# Altium schematic sheet vesc.SchDoc
size A4; SheetNumber: 1; SheetTotal: 5
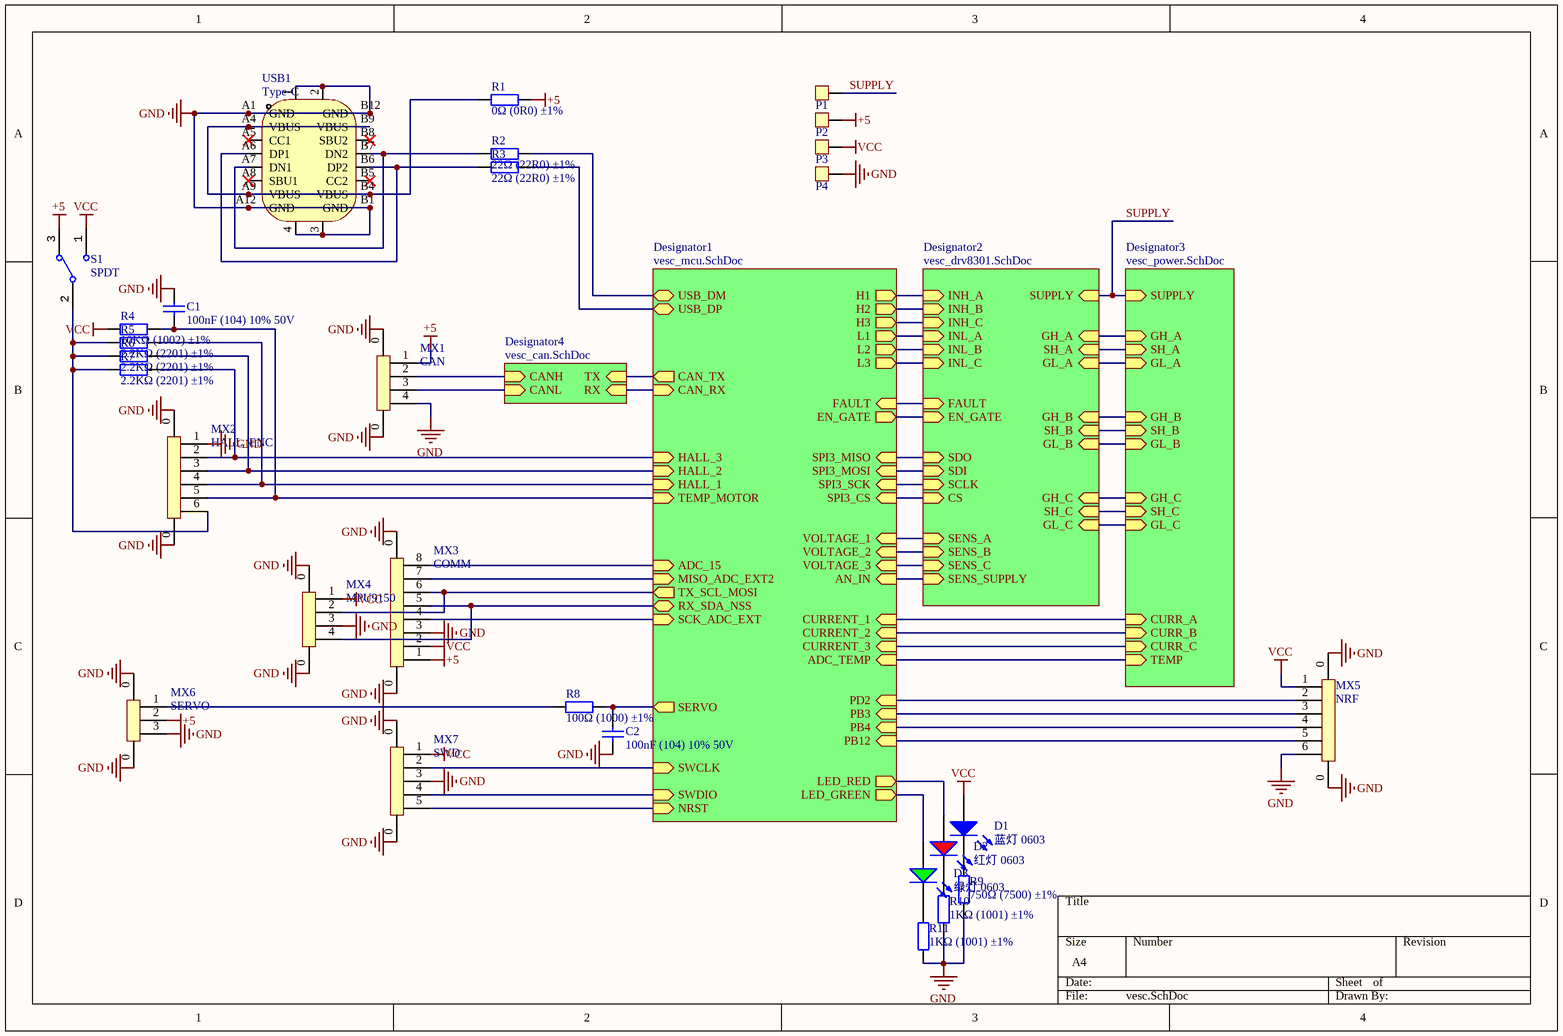
[diagram p0: vesc.SchDoc]

## Parts
C1  100nF (104) 10% 50V  [0603_C]
C2  100nF (104) 10% 50V  [0603_C]
D1  蓝灯 0603  [0603_LED_S1]
D2  红灯 0603  [0603_LED_S1]
D3  绿灯 0603  [0603_LED_S1]
MX1  CAN  [MX 1.25-WS-4P]
MX2  HALL_ENC  [MX 1.25-WS-6P]
MX3  COMM  [MX 1.25-WS-8P]
MX4  MPU9150  [MX 1.25-WS-4P]
MX5  NRF  [MX 1.25-WS-6P]
MX6  SERVO  [MX 1.25-WS-3P]
MX7  SWD  [MX 1.25-WS-5P]
P1  PAD  [PAD]  (value not drawn)
P2  PAD  [PAD]  (value not drawn)
P3  PAD  [PAD]  (value not drawn)
P4  PAD  [PAD]  (value not drawn)
R1  0Ω (0R0) ±1%  [0603_R]
R2  22Ω (22R0) ±1%  [0603_R]
R3  22Ω (22R0) ±1%  [0603_R]
R4  10KΩ (1002) ±1%  [0603_R]
R5  2.2KΩ (2201) ±1%  [0603_R]
R6  2.2KΩ (2201) ±1%  [0603_R]
R7  2.2KΩ (2201) ±1%  [0603_R]
R8  100Ω (1000) ±1%  [0603_R]
R9  750Ω (7500) ±1%  [0603_R]
R10  1KΩ (1001) ±1%  [0603_R]
R11  1KΩ (1001) ±1%  [0603_R]
S1  SPDT  [SwitchSPDT_4.3X8.6_D90]
USB1  Type-C  [TYPE-C_16P]

## Sub-sheets
Designator1 = vesc_mcu.SchDoc: NRST (in), VOLTAGE_1 (in), VOLTAGE_2 (in), VOLTAGE_3 (in), ADC_TEMP (in), RX_SDA_NSS (bidir), SCK_ADC_EXT (in), MISO_ADC_EXT2 (in), H1 (out), H2 (out), H3 (out), USB_DM (bidir), USB_DP (bidir), SWDIO (in), SWCLK (in), LED_GREEN (out), LED_RED (out), PB3 (in), PB4 (in), EN_GATE (out), SERVO (out), FAULT (in), CAN_RX (in), CAN_TX (out), PB12 (in), L1 (out), L2 (out), L3 (out), TX_SCL_MOSI (out), CURRENT_1 (in), CURRENT_2 (in), CURRENT_3 (in), AN_IN (in), TEMP_MOTOR (in), ADC_15 (in), HALL_1 (in), HALL_2 (in), HALL_3 (in), SPI3_CS (in), SPI3_SCK (in), SPI3_MISO (in), SPI3_MOSI (in), PD2 (in)
Designator2 = vesc_drv8301.SchDoc: SENS_SUPPLY (in), SUPPLY (in), SENS_A (in), SH_A (in), SENS_B (in), SENS_C (in), SH_C (in), FAULT (in), CS (in), SDI (in), SDO (in), SCLK (in), EN_GATE (in), INH_A (in), INL_A (in), INH_B (in), INL_B (in), INH_C (in), INL_C (in), GH_A (in), GL_A (in), GH_B (in), GL_B (in), GH_C (in), GL_C (in), SH_B (in)
Designator3 = vesc_power.SchDoc: GH_A (in), GL_A (in), SH_A (in), GH_B (in), GL_B (in), SH_B (in), GH_C (in), GL_C (in), SH_C (in), CURR_A (in), CURR_B (in), CURR_C (in), TEMP (in), SUPPLY (in)
Designator4 = vesc_can.SchDoc: TX (in), RX (in), CANH (in), CANL (in)

## Nets
+5: MX1.1 MX3.1 MX6.2 P2.1 R1.2 S1.3
GND: C1.2 C2.1 MX1.0 MX1.4 MX2.0 MX2.1 MX3.0 MX3.3 MX4.0 MX4.3 MX5.0 MX5.6 MX6.0 MX6.3 MX7.0 MX7.3 P4.1 R9.1 R10.1 R11.1 USB1.1 USB1.2 USB1.3 USB1.4 USB1.A1(GND) USB1.A12(GND) USB1.B1(GND) USB1.B12(GND)
VCC: D1.A MX3.2 MX4.1 MX5.1 MX7.1 P3.1 R4.1 S1.1
SUPPLY: P1.1 ; sheet Designator2/SUPPLY, sheet Designator3/SUPPLY
NetC1_1: C1.1 MX2.5 R4.2 ; sheet Designator1/TEMP_MOTOR
NetC2_2: C2.2 R8.2 ; sheet Designator1/SERVO
NetD1_K: D1.K R9.2
NetD2_A: D2.A ; sheet Designator1/LED_RED
NetD2_K: D2.K R10.2
NetD3_A: D3.A ; sheet Designator1/LED_GREEN
NetD3_K: D3.K R11.2
NetMX1_2: MX1.2 ; sheet Designator4/CANH
NetMX1_3: MX1.3 ; sheet Designator4/CANL
NetMX2_2: MX2.2 R7.2 ; sheet Designator1/HALL_3
NetMX2_3: MX2.3 R6.2 ; sheet Designator1/HALL_2
NetMX2_4: MX2.4 R5.2 ; sheet Designator1/HALL_1
NetMX2_6: MX2.6 R5.1 R6.1 R7.1 S1.2
NetMX3_4: MX3.4 ; sheet Designator1/SCK_ADC_EXT
NetMX3_5: MX3.5 MX4.4 ; sheet Designator1/RX_SDA_NSS
NetMX3_6: MX3.6 MX4.2 ; sheet Designator1/TX_SCL_MOSI
NetMX3_7: MX3.7 ; sheet Designator1/MISO_ADC_EXT2
NetMX3_8: MX3.8 ; sheet Designator1/ADC_15
NetMX5_2: MX5.2 ; sheet Designator1/PD2
NetMX5_3: MX5.3 ; sheet Designator1/PB3
NetMX5_4: MX5.4 ; sheet Designator1/PB4
NetMX5_5: MX5.5 ; sheet Designator1/PB12
NetMX6_1: MX6.1 R8.1
NetMX7_2: MX7.2 ; sheet Designator1/SWCLK
NetMX7_4: MX7.4 ; sheet Designator1/SWDIO
NetMX7_5: MX7.5 ; sheet Designator1/NRST
NetR1_1: R1.1 USB1.A4(VBUS) USB1.A9(VBUS) USB1.B4(VBUS) USB1.B9(VBUS)
NetR2_1: R2.1 USB1.A7(DN1) USB1.B7(DN2)
NetR2_2: R2.2 ; sheet Designator1/USB_DM
NetR3_1: R3.1 USB1.A6(DP1) USB1.B6(DP2)
NetR3_2: R3.2 ; sheet Designator1/USB_DP
(unnamed): sheet Designator4/TX, sheet Designator1/CAN_TX
(unnamed): sheet Designator4/RX, sheet Designator1/CAN_RX
(unnamed): sheet Designator1/VOLTAGE_1, sheet Designator2/SENS_A
(unnamed): sheet Designator1/VOLTAGE_2, sheet Designator2/SENS_B
(unnamed): sheet Designator1/VOLTAGE_3, sheet Designator2/SENS_C
(unnamed): sheet Designator1/ADC_TEMP, sheet Designator3/TEMP
(unnamed): sheet Designator1/H1, sheet Designator2/INH_A
(unnamed): sheet Designator1/H2, sheet Designator2/INH_B
(unnamed): sheet Designator1/H3, sheet Designator2/INH_C
(unnamed): sheet Designator1/EN_GATE, sheet Designator2/EN_GATE
(unnamed): sheet Designator1/FAULT, sheet Designator2/FAULT
(unnamed): sheet Designator1/L1, sheet Designator2/INL_A
(unnamed): sheet Designator1/L2, sheet Designator2/INL_B
(unnamed): sheet Designator1/L3, sheet Designator2/INL_C
(unnamed): sheet Designator1/CURRENT_1, sheet Designator3/CURR_A
(unnamed): sheet Designator1/CURRENT_2, sheet Designator3/CURR_B
(unnamed): sheet Designator1/CURRENT_3, sheet Designator3/CURR_C
(unnamed): sheet Designator1/AN_IN, sheet Designator2/SENS_SUPPLY
(unnamed): sheet Designator1/SPI3_CS, sheet Designator2/CS
(unnamed): sheet Designator1/SPI3_SCK, sheet Designator2/SCLK
(unnamed): sheet Designator1/SPI3_MISO, sheet Designator2/SDO
(unnamed): sheet Designator1/SPI3_MOSI, sheet Designator2/SDI
(unnamed): sheet Designator2/SH_A, sheet Designator3/SH_A
(unnamed): sheet Designator2/SH_C, sheet Designator3/SH_C
(unnamed): sheet Designator2/GH_A, sheet Designator3/GH_A
(unnamed): sheet Designator2/GL_A, sheet Designator3/GL_A
(unnamed): sheet Designator2/GH_B, sheet Designator3/GH_B
(unnamed): sheet Designator2/GL_B, sheet Designator3/GL_B
(unnamed): sheet Designator2/GH_C, sheet Designator3/GH_C
(unnamed): sheet Designator2/GL_C, sheet Designator3/GL_C
(unnamed): sheet Designator2/SH_B, sheet Designator3/SH_B

Not connected (* = marked no-connect by the designer): USB1 A5(CC1)* A8(SBU1)* B5(CC2)* B8(SBU2)*

## Library data of the parts
C1 C2 = 0603 100nF (104) 10% 50V: 贴片电容; ComponentLink1Description: 供应商链接; ComponentLink1URL: http://www.szlcsc.com/product/details_15331.html; Package: 0603; Supplier: LC; SuppliersPartNumber: C14663
D1 = 0603 蓝灯: 发光二极管; ComponentLink1Description: 供应商链接; ComponentLink1URL: http://www.szlcsc.com/product/details_73150.html; Package: 0603; Supplier: LC; SuppliersPartNumber: C72041
D2 = 0603 红灯: 发光二极管; ComponentLink1Description: 供应商链接; ComponentLink1URL: http://www.szlcsc.com/product/details_2659.html; Package: 0603; Supplier: LC; SuppliersPartNumber: C2286
D3 = 0603 绿灯: 发光二极管; ComponentLink1Description: 供应商链接; ComponentLink1URL: http://www.szlcsc.com/product/details_73152.html; Package: 0603; Supplier: LC; SuppliersPartNumber: C72043
MX1 MX4 = MX_WS_4P
MX2 MX5 = MX_WS_6P
MX3 = MX_WS_8P
MX6 = MX_WS_3P
MX7 = MX_WS_5P
P1-P4 = PAD: Manufacturer: AMASS(艾迈斯); Name: XT30U-M; Symbol: DC电源; Pin Type: IN; Add into BOM: yes; Device: XT30U-M; Convert to PCB: yes; Supplier Part: C99101; Supplier: LCSC; Manufacturer Part: XT30U-M; JLCPCB Part Class: 扩展库
R1 = 0603 0Ω (0R0) 1%: 贴片电阻; ComponentLink1Description: 供应商链接; ComponentLink1URL: http://www.szlcsc.com/product/details_21903.html; Package: 0603; Supplier: LC; SuppliersPartNumber: C21189
R2 R3 = 0603 22Ω (22R0) 1%: 贴片电阻; ComponentLink1Description: 供应商链接; ComponentLink1URL: http://www.szlcsc.com/product/details_24078.html; Package: 0603; Supplier: LC; SuppliersPartNumber: C23345
R4 = 0603 10KΩ (1002) 1%: 贴片电阻; ComponentLink1Description: 供应商链接; ComponentLink1URL: http://www.szlcsc.com/product/details_26547.html; Package: 0603; Supplier: LC; SuppliersPartNumber: C25804
R5-R7 = 0603 2.2KΩ (2201) 1%: 贴片电阻; ComponentLink1Description: 供应商链接; ComponentLink1URL: http://www.szlcsc.com/product/details_4597.html; Package: 0603; Supplier: LC; SuppliersPartNumber: C4190
R8 = 0603 100Ω (1000) 1%: 贴片电阻; ComponentLink1Description: 供应商链接; ComponentLink1URL: http://www.szlcsc.com/product/details_23502.html; Package: 0603; Supplier: LC; SuppliersPartNumber: C22775
R9 = 0603 750Ω (7500) 1%: 贴片电阻; ComponentLink1Description: 供应商链接; ComponentLink1URL: http://www.szlcsc.com/product/details_23968.html; Package: 0603; Supplier: LC; SuppliersPartNumber: C23241
R10 R11 = 0603 1KΩ (1001) 1%: 贴片电阻; ComponentLink1Description: 供应商链接; ComponentLink1URL: http://www.szlcsc.com/product/details_21904.html; Package: 0603; Supplier: LC; SuppliersPartNumber: C21190
S1 = SwitchSPDT_90DIP_4.3x8.6: Switch; Value: 4.2x8.6mm; Type: SPDT 3P
USB1 = USB-Type-C: USB-Type-C_16P